# Altium schematic sheet MEMORY.SchDoc
size A4
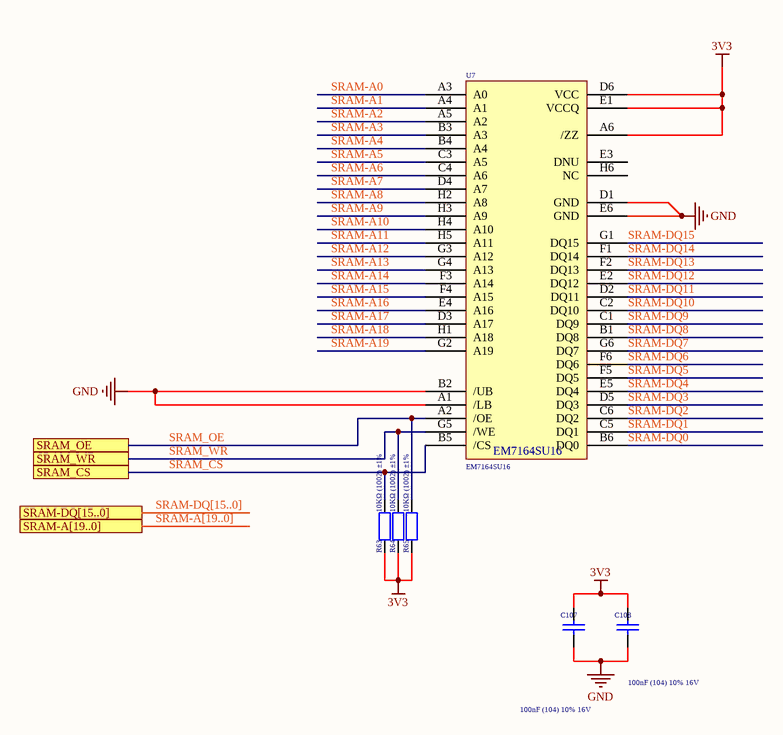
[diagram p0: MEMORY.SchDoc]

## Parts
C107  100nF (104) 10% 16V  [0402_C]
C108  100nF (104) 10% 16V  [0402_C]
R63  10KΩ (1002) ±1%  [0402_R]
R64  10KΩ (1002) ±1%  [0402_R]
R65  10KΩ (1002) ±1%  [0402_R]
U7  EM7164SU16  [BGA48C75P6X8_598X698X104]

## Ports
SRAM-A[19..0], SRAM-DQ[15..0], SRAM_CS, SRAM_OE, SRAM_WR

## Nets
3V3: C107.2 C108.2 R63.1 R64.1 R65.1 U7.A6(/ZZ) U7.D6(VCC) U7.E1(VCCQ)
GND: C107.1 C108.1 U7.A1(/LB) U7.B2(/UB) U7.D1(GND) U7.E6(GND)
SRAM-A0: U7.A3(A0)
SRAM-A1: U7.A4(A1)
SRAM-A2: U7.A5(A2)
SRAM-A3: U7.B3(A3)
SRAM-A4: U7.B4(A4)
SRAM-A5: U7.C3(A5)
SRAM-A6: U7.C4(A6)
SRAM-A7: U7.D4(A7)
SRAM-A8: U7.H2(A8)
SRAM-A9: U7.H3(A9)
SRAM-A10: U7.H4(A10)
SRAM-A11: U7.H5(A11)
SRAM-A12: U7.G3(A12)
SRAM-A13: U7.G4(A13)
SRAM-A14: U7.F3(A14)
SRAM-A15: U7.F4(A15)
SRAM-A16: U7.E4(A16)
SRAM-A17: U7.D3(A17)
SRAM-A18: U7.H1(A18)
SRAM-A19: U7.G2(A19)
SRAM-DQ0: U7.B6(DQ0)
SRAM-DQ1: U7.C5(DQ1)
SRAM-DQ2: U7.C6(DQ2)
SRAM-DQ3: U7.D5(DQ3)
SRAM-DQ4: U7.E5(DQ4)
SRAM-DQ5: U7.F5(DQ5)
SRAM-DQ6: U7.F6(DQ6)
SRAM-DQ7: U7.G6(DQ7)
SRAM-DQ8: U7.B1(DQ8)
SRAM-DQ9: U7.C1(DQ9)
SRAM-DQ10: U7.C2(DQ10)
SRAM-DQ11: U7.D2(DQ11)
SRAM-DQ12: U7.E2(DQ12)
SRAM-DQ13: U7.F2(DQ13)
SRAM-DQ14: U7.F1(DQ14)
SRAM-DQ15: U7.G1(DQ15)
SRAM_CS: R63.2 U7.B5(/CS) ; port SRAM_CS
SRAM_OE: R65.2 U7.A2(/OE) ; port SRAM_OE
SRAM_WR: R64.2 U7.G5(/WE) ; port SRAM_WR

Not connected (* = marked no-connect by the designer): U7 E3(DNU) H6(NC)

## Buses and harness runs
bus SRAM-A[19..0] = port SRAM-A[19..0]
bus SRAM-DQ[15..0] = port SRAM-DQ[15..0]

## Library data of the parts
C107 C108 = 0402 100nF (104) 10% 16V: 贴片电容; ComponentLink1Description: 供应商链接; ComponentLink1URL: http://www.szlcsc.com/product/details_1877.html; Package: 0402; Supplier: LC; SuppliersPartNumber: C1525
R63-R65 = 0402 10KΩ (1002) 1%: 贴片电阻; ComponentLink1Description: 供应商链接; ComponentLink1URL: http://www.szlcsc.com/product/details_26487.html; Package: 0402; Supplier: LC; SuppliersPartNumber: C25744